# Altium schematic sheet battery-led.SchDoc
size A4
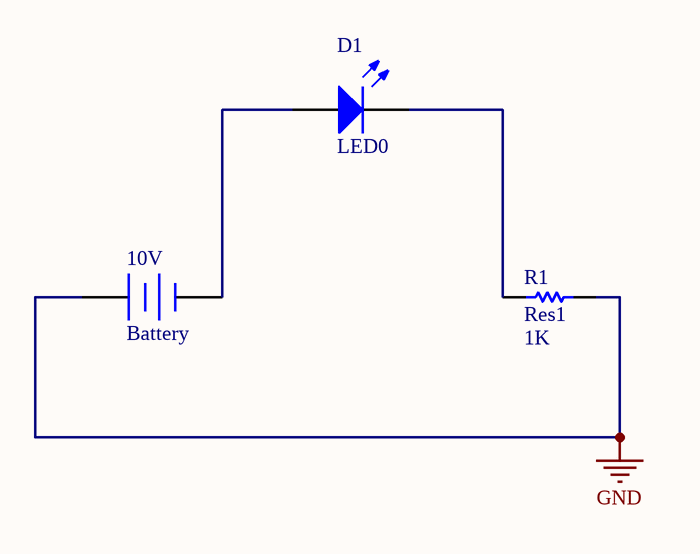
[diagram p0: battery-led.SchDoc]

## Parts
10V  Battery  [BAT-2]
D1  LED0  [LED-0]
R1  Res1  value 1K  [AXIAL-0.3]

## Nets
GND: 10V.1(+) R1.2
Net10V_2: 10V.2(-) D1.1(A)
NetD1_2: D1.2(K) R1.1

## Library data of the parts
10V = Battery: Multicell Battery; Published: 24-Mar-1999; LatestRevisionDate: 17-Jul-2002; LatestRevisionNote: Re-released for DXP Platform.; PackageReference: BAT-2; Publisher: Altium Limited; PackageDescription: Battery; 2 Leads
D1 = LED0: Typical INFRARED GaAs LED; Published: 8-Jun-2000; LatestRevisionDate: 08-Jul-2005; LatestRevisionNote: Mech Layer 1 removed.; PackageReference: LED-0; Publisher: Altium Limited; PackageDescription: LED; 2 Leads
R1 = Res1: Resistor; Published: 8-Jun-2000; LatestRevisionDate: 17-Jul-2002; LatestRevisionNote: Re-released for DXP Platform.; PackageReference: AXIAL-0.3; Publisher: Altium Limited; PackageDescription: Axial Device, Thru-Hole; 2 Leads; 0.3 in Pin Spacing